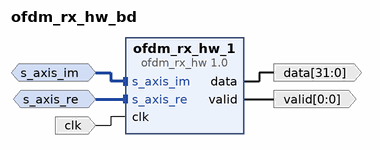
[diagram p0: block diagram of the top level]
# Vivado block design ofdm_rx_hw_bd, xczu28dr-ffvg1517-2-e, Vivado 2020.1
create_bd_design ofdm_rx_hw_bd

create_bd_intf_port -mode Slave -vlnv xilinx.com:interface:axis_rtl:1.0 s_axis_im
set_property -dict [list \
  CONFIG.TDATA_NUM_BYTES 16 \
  CONFIG.TDEST_WIDTH 0 \
  CONFIG.TID_WIDTH 0 \
  CONFIG.TUSER_WIDTH 0 \
  CONFIG.HAS_TREADY 1 \
  CONFIG.HAS_TSTRB 0 \
  CONFIG.HAS_TKEEP 0 \
  CONFIG.HAS_TLAST 0 \
  CONFIG.LAYERED_METADATA undef \
] [get_bd_intf_ports s_axis_im]
create_bd_intf_port -mode Slave -vlnv xilinx.com:interface:axis_rtl:1.0 s_axis_re
set_property -dict [list \
  CONFIG.TDATA_NUM_BYTES 16 \
  CONFIG.TDEST_WIDTH 0 \
  CONFIG.TID_WIDTH 0 \
  CONFIG.TUSER_WIDTH 0 \
  CONFIG.HAS_TREADY 1 \
  CONFIG.HAS_TSTRB 0 \
  CONFIG.HAS_TKEEP 0 \
  CONFIG.HAS_TLAST 0 \
  CONFIG.LAYERED_METADATA undef \
] [get_bd_intf_ports s_axis_re]
create_bd_port -dir I -type clk clk
create_bd_port -dir O -from 31 -to 0 -type data data
create_bd_port -dir O -from 0 -to 0 -type data valid

create_bd_cell -type ip -vlnv User_Company:SysGen:ofdm_rx_hw:1.0 ofdm_rx_hw_1

# ---- connections ----

connect_bd_intf_net [get_bd_intf_ports s_axis_im] [get_bd_intf_pins ofdm_rx_hw_1/s_axis_im]
connect_bd_intf_net [get_bd_intf_ports s_axis_re] [get_bd_intf_pins ofdm_rx_hw_1/s_axis_re]
connect_bd_net [get_bd_ports clk] [get_bd_pins ofdm_rx_hw_1/clk]
connect_bd_net [get_bd_pins ofdm_rx_hw_1/data] [get_bd_ports data]
connect_bd_net [get_bd_pins ofdm_rx_hw_1/valid] [get_bd_ports valid]

validate_bd_design
save_bd_design
